# Altium project linuxcard.PrjPCB
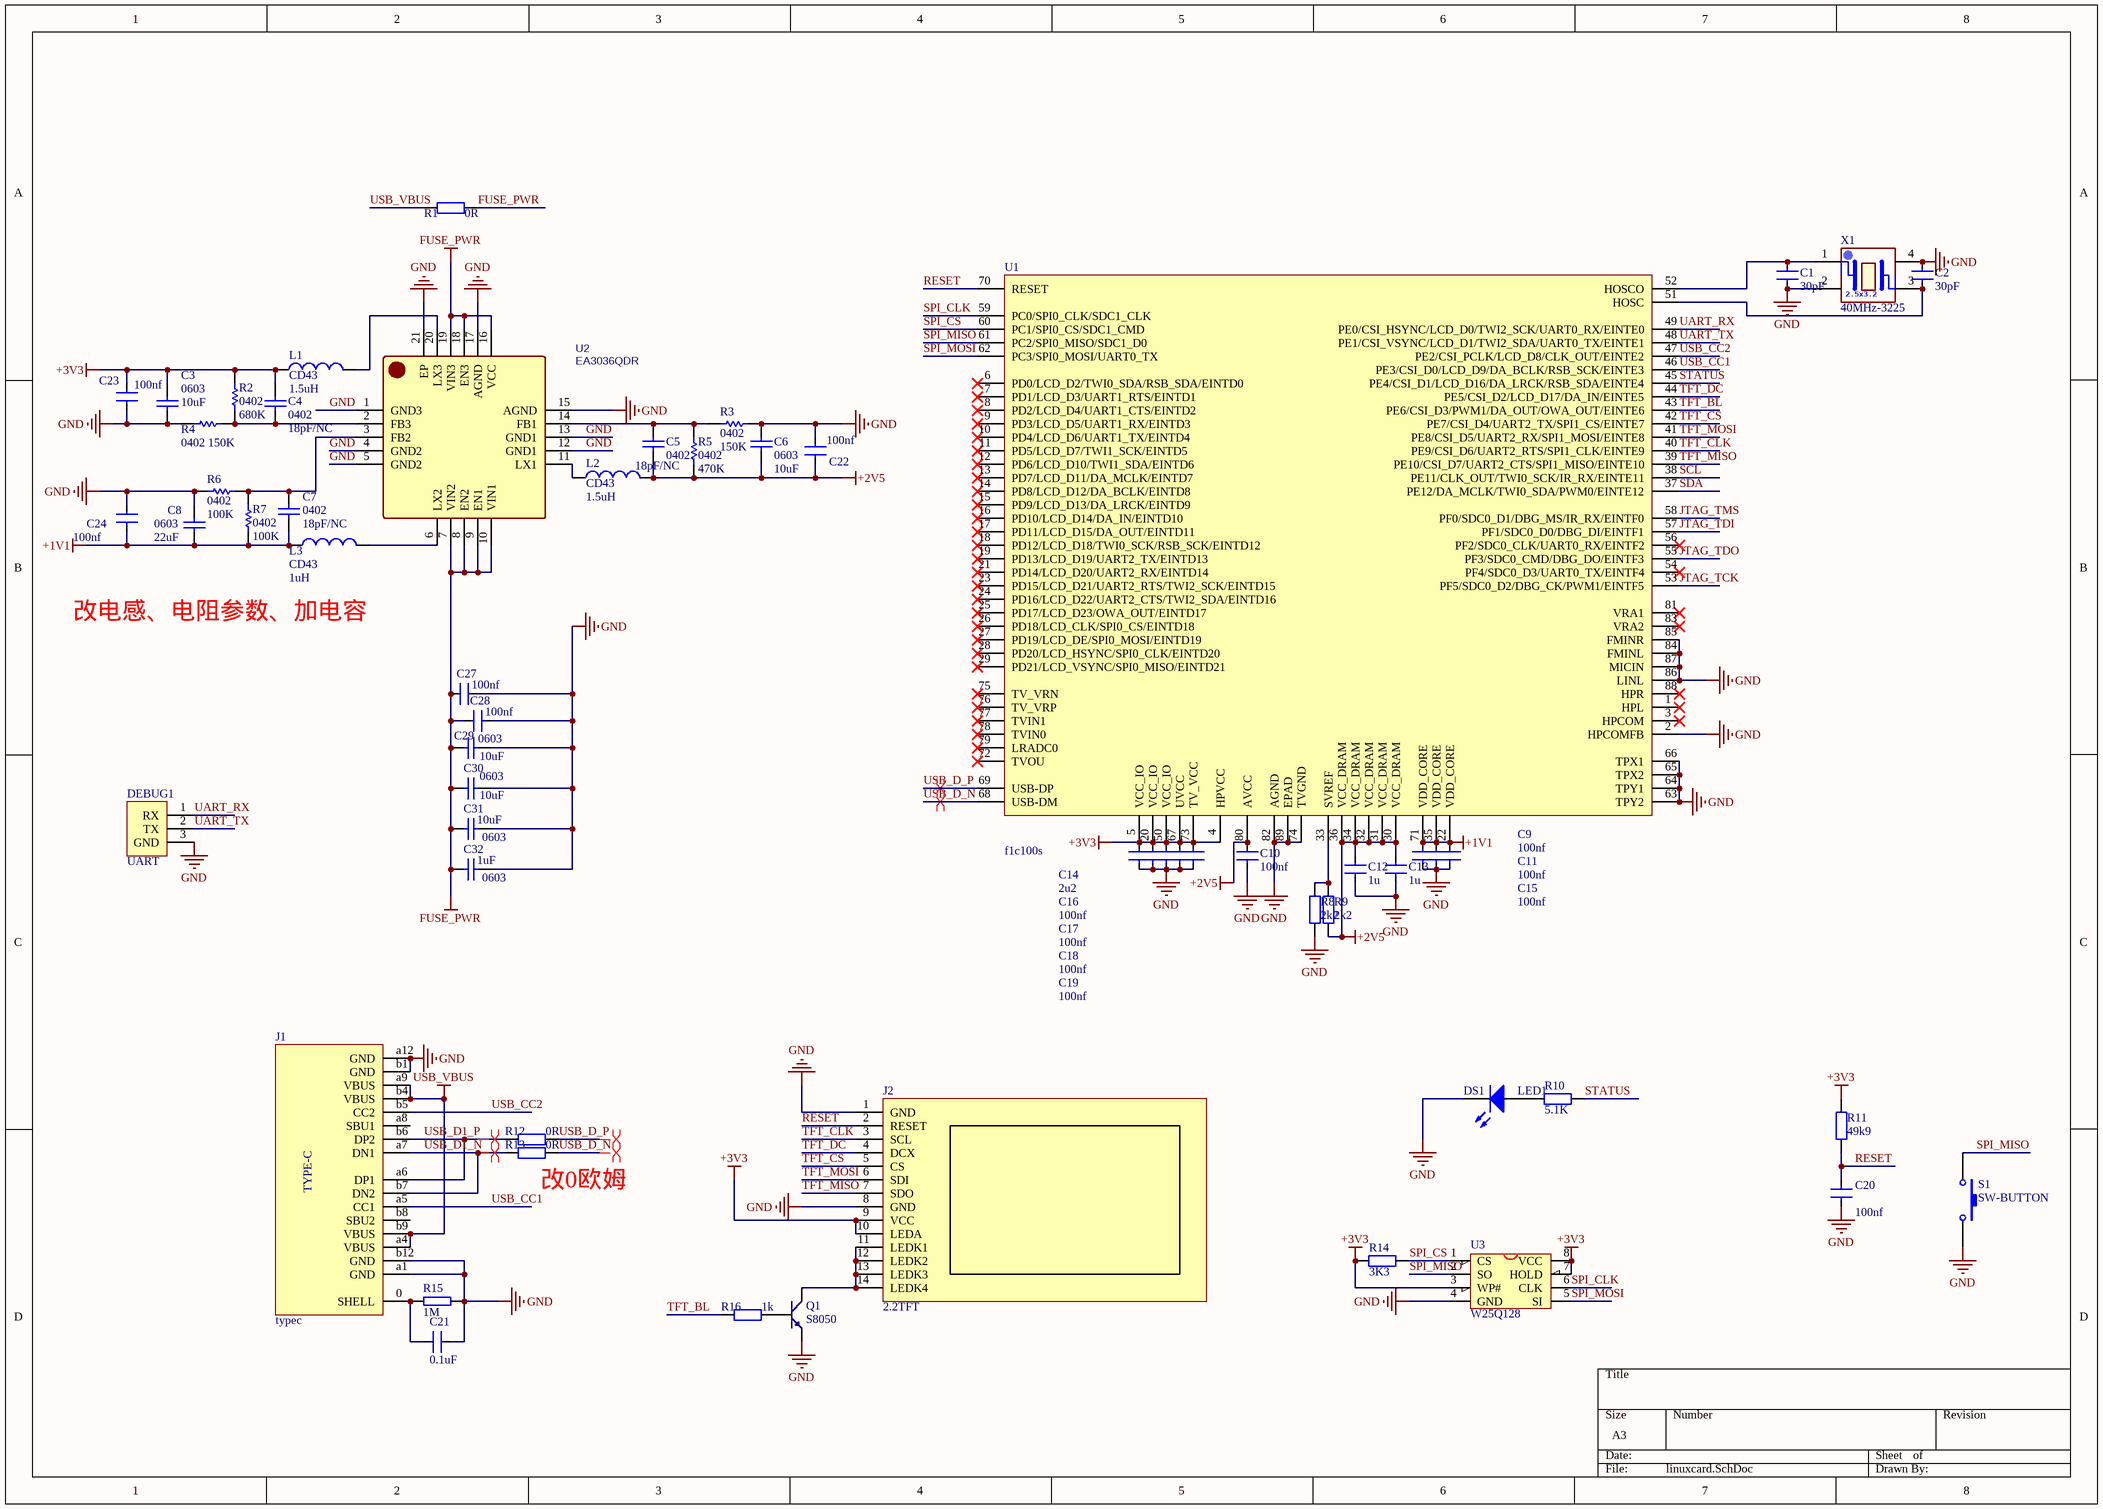
[diagram p0: linuxcard.SchDoc]
1 sheet, 59 parts. Net scope: global (net labels, ports and power ports of the same name join across sheets).
Board file: linuxcard.PcbDoc

## Sheet linuxcard.SchDoc
size A3

### Parts
C1  30pF  [C0402]
C2  30pF  [C0402]
C3  0603  value 10uF  [C0603]
C4  0402  value 18pF/NC  [C0402]
C5  0402  value 18pF/NC  [C0402]
C6  0603  value 10uF  [C0603]
C7  0402  value 18pF/NC  [C0402]
C8  0603  value 22uF  [C0603]
C9  100nf  [C0402]
C10  100nf  [C0402]
C11  100nf  [C0402]
C12  1u  [C0402]
C13  1u  [C0402]
C14  2u2  [C0402]
C15  100nf  [C0402]
C16  100nf  [C0402]
C17  100nf  [C0402]
C18  100nf  [C0402]
C19  100nf  [C0402]
C20  100nf  [C0402]
C21  0.1uF  [C0402]
C22  100nf  [C0402]
C23  100nf  [C0402]
C24  100nf  [C0402]
C27  100nf  [C0402]
C28  100nf  [C0402]
C29  0603  value 10uF  [C0603]
C30  0603  value 10uF  [C0603]
C31  0603  value 10uF  [C0603]
C32  0603  value 1uF  [C0603]
DEBUG1  UART  [UART]
DS1  LED1  [LED0805]
J1  typec  [USBC]
J2  2.2TFT  [2.2TFT]
L1  CD43  value 1.5uH  [L1210]
L2  CD43  value 1.5uH  [L1210]
L3  CD43  value 1uH  [L1210]
Q1  S8050  [sot-23]
R1  0R  [R0805]
R2  0402  value 680K  [R0402]
R3  0402  value 150K  [R0402]
R4  0402  value 150K  [R0402]
R5  0402  value 470K  [R0402]
R6  0402  value 100K  [R0402]
R7  0402  value 100K  [R0402]
R8  2k2  [R0402]
R9  2k2  [R0402]
R10  5.1K  [R0402]
R11  49k9  [R0402]
R12  0R  [R0402]
R13  0R  [R0402]
R14  3K3  [R0402]
R15  1M  [R0402]
R16  1k  [R0402]
S1  SW-BUTTON  [KEY-SMD1]
U1  f1c100s  [F1C100S]
U2  EA3036QDR  [ea3036]
U3  W25Q128  [SOIC8]
X1  40MHz-3225  [XTAL-3225]

### Nets
+1V1: C7.1 C8.2 C9.2 C11.2 C15.2 C24.1 L3.1 R7.1 U1.22(VDD_CORE) U1.35(VDD_CORE) U1.71(VDD_CORE)
+2V5: C5.1 C6.1 C10.2 C12.2 C13.2 C22.1 L2.2 R5.2 R9.2 U1.30(VCC_DRAM) U1.31(VCC_DRAM) U1.32(VCC_DRAM) U1.34(VCC_DRAM) U1.36(VCC_DRAM) U1.80(AVCC)
+3V3: C3.1 C4.1 C14.2 C16.2 C17.2 C18.2 C19.2 C23.2 J2.9(VCC) J2.10(LEDA) L1.1 R2.2 R11.1 R14.2 U1.4(HPVCC) U1.5(VCC_IO) U1.20(VCC_IO) U1.50(VCC_IO) U1.67(UVCC) U1.73(TV_VCC) U3.3(WP#) U3.7(HOLD) U3.8(VCC)
FUSE_PWR: C27.2 C28.2 C29.1 C30.1 C31.1 C32.1 R1.2 U2.7(VIN2) U2.8(EN2) U2.9(EN1) U2.10(VIN1) U2.16(VCC) U2.18(EN3) U2.19(VIN3)
GND: C1.1 C2.2 C3.2 C6.2 C8.1 C9.1 C10.1 C11.1 C12.1 C13.1 C14.1 C15.1 C16.1 C17.1 C18.1 C19.1 C20.1 C21.1 C22.2 C23.1 C24.2 C27.1 C28.1 C29.2 C30.2 C31.2 C32.2 DEBUG1.3(GND) DS1.2(K) J1.a1(GND) J1.a12(GND) J1.b1(GND) J1.b12(GND) J2.1(GND) J2.8(GND) Q1.1(E) R3.2 R4.2 R6.2 R8.2 R15.1 S1.2 U1.2(HPCOMFB) U1.63(TPY2) U1.64(TPY1) U1.65(TPX2) U1.66(TPX1) U1.74(TVGND) U1.82(AGND) U1.84(FMINL) U1.85(FMINR) U1.86(LINL) U1.87(MICIN) U1.89(EPAD) U2.1(GND3) U2.4(GND2) U2.5(GND2) U2.12(GND1) U2.13(GND1) U2.15(AGND) U2.17(AGND) U2.21(EP) U3.4(GND) X1.2(NC1) X1.4(NC2)
USB_VBUS: J1.a4(VBUS) J1.a9(VBUS) J1.b4(VBUS) J1.b9(VBUS) R1.1
JTAG_TCK: U1.53(PF5/SDC0_D2/DBG_CK/PWM1/EINTF5)
JTAG_TDI: U1.57(PF1/SDC0_D0/DBG_DI/EINTF1)
JTAG_TDO: U1.55(PF3/SDC0_CMD/DBG_DO/EINTF3)
JTAG_TMS: U1.58(PF0/SDC0_D1/DBG_MS/IR_RX/EINTF0)
RESET: C20.2 J2.2(RESET) R11.2 U1.70(RESET)
SCL: U1.38(PE11/CLK_OUT/TWI0_SCK/IR_RX/EINTE11)
SDA: U1.37(PE12/DA_MCLK/TWI0_SDA/PWM0/EINTE12)
SPI_CLK: U1.59(PC0/SPI0_CLK/SDC1_CLK) U3.6(CLK)
SPI_CS: R14.1 U1.60(PC1/SPI0_CS/SDC1_CMD) U3.1(CS)
SPI_MISO: S1.1 U1.61(PC2/SPI0_MISO/SDC1_D0) U3.2(SO)
SPI_MOSI: U1.62(PC3/SPI0_MOSI/UART0_TX) U3.5(SI)
STATUS: R10.2 U1.45(PE4/CSI_D1/LCD_D16/DA_LRCK/RSB_SDA/EINTE4)
TFT_BL: R16.1 U1.43(PE6/CSI_D3/PWM1/DA_OUT/OWA_OUT/EINTE6)
TFT_CLK: J2.3(SCL) U1.40(PE9/CSI_D6/UART2_RTS/SPI1_CLK/EINTE9)
TFT_CS: J2.5(CS) U1.42(PE7/CSI_D4/UART2_TX/SPI1_CS/EINTE7)
TFT_DC: J2.4(DCX) U1.44(PE5/CSI_D2/LCD_D17/DA_IN/EINTE5)
TFT_MISO: J2.7(SDO) U1.39(PE10/CSI_D7/UART2_CTS/SPI1_MISO/EINTE10)
TFT_MOSI: J2.6(SDI) U1.41(PE8/CSI_D5/UART2_RX/SPI1_MOSI/EINTE8)
UART_RX: DEBUG1.1(RX) U1.49(PE0/CSI_HSYNC/LCD_D0/TWI2_SCK/UART0_RX/EINTE0)
UART_TX: DEBUG1.2(TX) U1.48(PE1/CSI_VSYNC/LCD_D1/TWI2_SDA/UART0_TX/EINTE1)
USB_CC1: J1.a5(CC1) U1.46(PE3/CSI_D0/LCD_D9/DA_BCLK/RSB_SCK/EINTE3)
USB_CC2: J1.b5(CC2) U1.47(PE2/CSI_PCLK/LCD_D8/CLK_OUT/EINTE2)
USB_D1_N: J1.a7(DN1) J1.b7(DN2) R13.1
USB_D1_P: J1.a6(DP1) J1.b6(DP2) R12.1
USB_D_N: R13.2 U1.68(USB-DM)
USB_D_P: R12.2 U1.69(USB-DP)
NetC1_2: C1.2 U1.52(HOSCO) X1.1(X1)
NetC2_1: C2.1 U1.51(HOSC) X1.3(X2)
NetC4_2: C4.2 R2.1 R4.1 U2.2(FB3)
NetC5_2: C5.2 R3.1 R5.1 U2.14(FB1)
NetC7_2: C7.2 R6.1 R7.2 U2.3(FB2)
NetC21_2: C21.2 J1.0(SHELL) R15.2
NetDS1_1: DS1.1(A) R10.1
NetJ2_11: J2.11(LEDK1) J2.12(LEDK2) J2.13(LEDK3) J2.14(LEDK4) Q1.3(C)
NetL1_2: L1.2 U2.20(LX3)
NetL2_1: L2.1 U2.11(LX1)
NetL3_2: L3.2 U2.6(LX2)
NetQ1_2: Q1.2(B) R16.2
NetR8_1: R8.1 R9.1 U1.33(SVREF)

Not connected (* = marked no-connect by the designer): J1 a8(SBU1) b8(SBU2); U1 1(HPL)* 3(HPCOM)* 6(PD0/LCD_D2/TWI0_SDA/RSB_SDA/EINTD0)* 7(PD1/LCD_D3/UART1_RTS/EINTD1)* 8(PD2/LCD_D4/UART1_CTS/EINTD2)* 9(PD3/LCD_D5/UART1_RX/EINTD3)* 10(PD4/LCD_D6/UART1_TX/EINTD4)* 11(PD5/LCD_D7/TWI1_SCK/EINTD5)* 12(PD6/LCD_D10/TWI1_SDA/EINTD6)* 13(PD7/LCD_D11/DA_MCLK/EINTD7)* 14(PD8/LCD_D12/DA_BCLK/EINTD8)* 15(PD9/LCD_D13/DA_LRCK/EINTD9)* 16(PD10/LCD_D14/DA_IN/EINTD10)* 17(PD11/LCD_D15/DA_OUT/EINTD11)* 18(PD12/LCD_D18/TWI0_SCK/RSB_SCK/EINTD12)* 19(PD13/LCD_D19/UART2_TX/EINTD13)* 21(PD14/LCD_D20/UART2_RX/EINTD14)* 23(PD15/LCD_D21/UART2_RTS/TWI2_SCK/EINTD15)* 24(PD16/LCD_D22/UART2_CTS/TWI2_SDA/EINTD16)* 25(PD17/LCD_D23/OWA_OUT/EINTD17)* 26(PD18/LCD_CLK/SPI0_CS/EINTD18)* 27(PD19/LCD_DE/SPI0_MOSI/EINTD19)* 28(PD20/LCD_HSYNC/SPI0_CLK/EINTD20)* 29(PD21/LCD_VSYNC/SPI0_MISO/EINTD21)* 54(PF4/SDC0_D3/UART0_TX/EINTF4)* 56(PF2/SDC0_CLK/UART0_RX/EINTF2)* 72(TVOU)* 75(TV_VRN)* 76(TV_VRP)* 77(TVIN1)* 78(TVIN0)* 79(LRADC0)* 81(VRA1)* 83(VRA2)* 88(HPR)*

### Layout directives
differential pair: USB_D1_N, USB_D1_P, USB_D_N, USB_D_P

### Notes on the sheet
- 改电感、电阻参数、加电容
- (near R13) 改0欧姆
- (in symbol USBC) TYPE-C
- (in symbol XTAL3225) 2.5x3.2

### Library data of the parts
C1 C2 C9-C24 C27 C28 = CAP: 普通小电容
C3-C8 C29-C32 = Cap: Capacitor; Published: 8-Jun-2000; LatestRevisionDate: 17-Jul-2002; LatestRevisionNote: Re-released for DXP Platform.; PackageReference: RAD-0.3; Publisher: Altium Limited
DEBUG1 = UART_OUT
DS1 = LED2: Typical RED, GREEN, YELLOW, AMBER GaAs LED; Published: 8-Jun-2000; LatestRevisionDate: 17-Jul-2002; LatestRevisionNote: Re-released for DXP Platform.; PackageDocument: Feb-2002; PackageReference: 3.2X1.6X1.1; Publisher: Altium Limited
J1 = USBC
J2 = TFT2.2
L1-L3 = Inductor: Code_IEC: 1005; Published: 8-Jun-2000; LatestRevisionDate: 29-May-2009; LatestRevisionNote: IPC-7351 Footprint Added.; PackageReference: 0402-A; Publisher: Altium Limited; PackageDescription: Chip Inductor; Code_JEITA: 0402
Q1 = NPN: 8050/BCW846/BCW847
R1 R8-R14 R16 = RES: 普通电阻
R2 R5-R7 = Res1: Published: 8-Jun-2000; LatestRevisionDate: 17-Jul-2002; LatestRevisionNote: Re-released for DXP Platform.; PackageReference: AXIAL-0.3; Publisher: Altium Limited
R3 R4 = Res1: Resistor; Published: 8-Jun-2000; LatestRevisionDate: 17-Jul-2002; LatestRevisionNote: Re-released for DXP Platform.; PackageReference: AXIAL-0.3; Publisher: Altium Limited
R15 = 0805正
U2 = EA3036QDR: BOM_Manufacturer: Everanalog; spicePre: X; BOM_Manufacturer Part: EA3036QDR; BOM_Supplier: LCSC; BOM_Supplier Part: C111587
U3 = W25X16: W25X16;SST25VF016;MX25L1605
X1 = XTAL3225